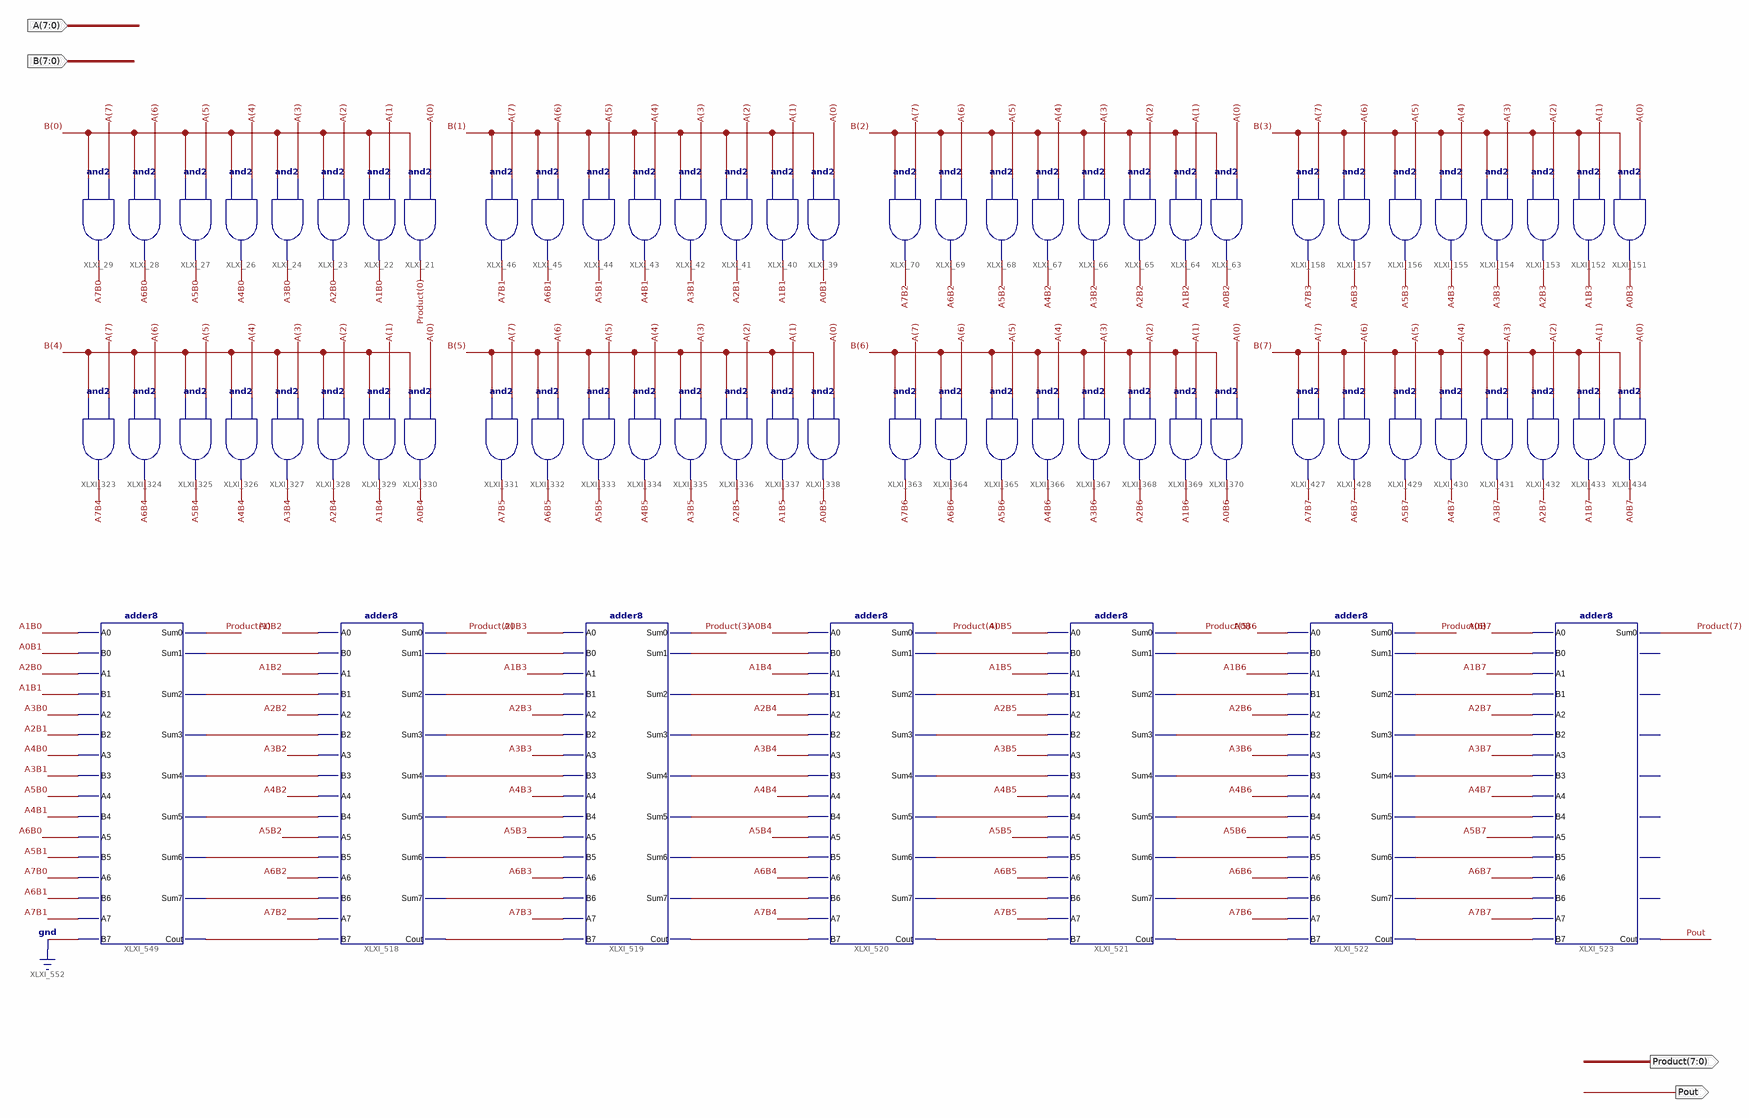
[diagram p0: schematic sheet 1]
// Xilinx ISE schematic EightBitMultiplier.sch (spartan6) as structural Verilog: 71 symbols, 4 ports
module EightBitMultiplier (
  input  [7:0] A,
  input  [7:0] B,
  output [7:0] Product,
  output Pout
);

  wire A0B1, A0B2, A0B3, A0B4, A0B5, A0B6, A0B7, A1B0, A1B1, A1B2, A1B3, A1B4, A1B5, A1B6, A1B7, A2B0, A2B1,
       A2B2, A2B3, A2B4, A2B5, A2B6, A2B7, A3B0, A3B1, A3B2, A3B3, A3B4, A3B5, A3B6, A3B7, A4B0, A4B1, A4B2,
       A4B3, A4B4, A4B5, A4B6, A4B7, A5B0, A5B1, A5B2, A5B3, A5B4, A5B5, A5B6, A5B7, A6B0, A6B1, A6B2, A6B3,
       A6B4, A6B5, A6B6, A6B7, A7B0, A7B1, A7B2, A7B3, A7B4, A7B5, A7B6, A7B7, XLXN_638, XLXN_1408,
       XLXN_1409, XLXN_1410, XLXN_1411, XLXN_1412, XLXN_1413, XLXN_1414, XLXN_1415, XLXN_1514, XLXN_1515,
       XLXN_1516, XLXN_1517, XLXN_1518, XLXN_1519, XLXN_1520, XLXN_1521, XLXN_1522, XLXN_1523, XLXN_1524,
       XLXN_1525, XLXN_1526, XLXN_1527, XLXN_1528, XLXN_1545, XLXN_1546, XLXN_1547, XLXN_1548, XLXN_1549,
       XLXN_1550, XLXN_1551, XLXN_1552, XLXN_1570, XLXN_1571, XLXN_1572, XLXN_1573, XLXN_1574, XLXN_1575,
       XLXN_1576, XLXN_1577, XLXN_1595, XLXN_1596, XLXN_1597, XLXN_1598, XLXN_1599, XLXN_1600, XLXN_1601,
       XLXN_1602;

  and XLXI_29 (A7B0, B[0], A[7]);
  and XLXI_28 (A6B0, B[0], A[6]);
  and XLXI_27 (A5B0, B[0], A[5]);
  and XLXI_26 (A4B0, B[0], A[4]);
  and XLXI_24 (A3B0, B[0], A[3]);
  and XLXI_23 (A2B0, B[0], A[2]);
  and XLXI_22 (A1B0, B[0], A[1]);
  and XLXI_21 (Product[0], B[0], A[0]);
  and XLXI_323 (A7B4, B[4], A[7]);
  and XLXI_324 (A6B4, B[4], A[6]);
  and XLXI_325 (A5B4, B[4], A[5]);
  and XLXI_326 (A4B4, B[4], A[4]);
  and XLXI_327 (A3B4, B[4], A[3]);
  and XLXI_328 (A2B4, B[4], A[2]);
  and XLXI_329 (A1B4, B[4], A[1]);
  and XLXI_330 (A0B4, B[4], A[0]);
  and XLXI_331 (A7B5, B[5], A[7]);
  and XLXI_332 (A6B5, B[5], A[6]);
  and XLXI_333 (A5B5, B[5], A[5]);
  and XLXI_334 (A4B5, B[5], A[4]);
  and XLXI_335 (A3B5, B[5], A[3]);
  and XLXI_336 (A2B5, B[5], A[2]);
  and XLXI_337 (A1B5, B[5], A[1]);
  and XLXI_338 (A0B5, B[5], A[0]);
  and XLXI_363 (A7B6, B[6], A[7]);
  and XLXI_364 (A6B6, B[6], A[6]);
  and XLXI_365 (A5B6, B[6], A[5]);
  and XLXI_366 (A4B6, B[6], A[4]);
  and XLXI_367 (A3B6, B[6], A[3]);
  and XLXI_368 (A2B6, B[6], A[2]);
  and XLXI_369 (A1B6, B[6], A[1]);
  and XLXI_370 (A0B6, B[6], A[0]);
  and XLXI_39 (A0B1, B[1], A[0]);
  and XLXI_40 (A1B1, B[1], A[1]);
  and XLXI_41 (A2B1, B[1], A[2]);
  and XLXI_42 (A3B1, B[1], A[3]);
  and XLXI_43 (A4B1, B[1], A[4]);
  and XLXI_44 (A5B1, B[1], A[5]);
  and XLXI_45 (A6B1, B[1], A[6]);
  and XLXI_46 (A7B1, B[1], A[7]);
  and XLXI_63 (A0B2, B[2], A[0]);
  and XLXI_64 (A1B2, B[2], A[1]);
  and XLXI_65 (A2B2, B[2], A[2]);
  and XLXI_66 (A3B2, B[2], A[3]);
  and XLXI_67 (A4B2, B[2], A[4]);
  and XLXI_68 (A5B2, B[2], A[5]);
  and XLXI_69 (A6B2, B[2], A[6]);
  and XLXI_70 (A7B2, B[2], A[7]);
  and XLXI_151 (A0B3, B[3], A[0]);
  and XLXI_152 (A1B3, B[3], A[1]);
  and XLXI_153 (A2B3, B[3], A[2]);
  and XLXI_154 (A3B3, B[3], A[3]);
  and XLXI_155 (A4B3, B[3], A[4]);
  and XLXI_156 (A5B3, B[3], A[5]);
  and XLXI_157 (A6B3, B[3], A[6]);
  and XLXI_158 (A7B3, B[3], A[7]);
  and XLXI_427 (A7B7, B[7], A[7]);
  and XLXI_428 (A6B7, B[7], A[6]);
  and XLXI_429 (A5B7, B[7], A[5]);
  and XLXI_430 (A4B7, B[7], A[4]);
  and XLXI_431 (A3B7, B[7], A[3]);
  and XLXI_432 (A2B7, B[7], A[2]);
  and XLXI_433 (A1B7, B[7], A[1]);
  and XLXI_434 (A0B7, B[7], A[0]);
  adder8 XLXI_523 (
    .A0(A0B7), .B0(XLXN_1602), .A1(A1B7), .B6(XLXN_1596), .B7(XLXN_1595), .B5(XLXN_1597), .B4(XLXN_1598),
    .B3(XLXN_1599), .B2(XLXN_1600), .B1(XLXN_1601), .A2(A2B7), .A3(A3B7), .A4(A4B7), .A5(A5B7), .A6(A6B7),
    .A7(A7B7), .Cout(Pout), .Sum0(Product[7]));  // open: Sum6, Sum7, Sum5, Sum4, Sum3, Sum2, Sum1
  adder8 XLXI_522 (
    .A0(A0B6), .B0(XLXN_1577), .A1(A1B6), .B6(XLXN_1571), .B7(XLXN_1570), .B5(XLXN_1572), .B4(XLXN_1573),
    .B3(XLXN_1574), .B2(XLXN_1575), .B1(XLXN_1576), .A2(A2B6), .A3(A3B6), .A4(A4B6), .A5(A5B6), .A6(A6B6),
    .A7(A7B6), .Sum6(XLXN_1597), .Cout(XLXN_1595), .Sum7(XLXN_1596), .Sum5(XLXN_1598), .Sum4(XLXN_1599),
    .Sum3(XLXN_1600), .Sum2(XLXN_1601), .Sum0(Product[6]), .Sum1(XLXN_1602));
  adder8 XLXI_520 (
    .A0(A0B4), .B0(XLXN_1528), .A1(A1B4), .B6(XLXN_1522), .B7(XLXN_1521), .B5(XLXN_1523), .B4(XLXN_1524),
    .B3(XLXN_1525), .B2(XLXN_1526), .B1(XLXN_1527), .A2(A2B4), .A3(A3B4), .A4(A4B4), .A5(A5B4), .A6(A6B4),
    .A7(A7B4), .Sum6(XLXN_1547), .Cout(XLXN_1545), .Sum7(XLXN_1546), .Sum5(XLXN_1548), .Sum4(XLXN_1549),
    .Sum3(XLXN_1550), .Sum2(XLXN_1551), .Sum0(Product[4]), .Sum1(XLXN_1552));
  adder8 XLXI_519 (
    .A0(A0B3), .B0(XLXN_1520), .A1(A1B3), .B6(XLXN_1515), .B7(XLXN_1514), .B5(XLXN_638), .B4(XLXN_1516),
    .B3(XLXN_1517), .B2(XLXN_1518), .B1(XLXN_1519), .A2(A2B3), .A3(A3B3), .A4(A4B3), .A5(A5B3), .A6(A6B3),
    .A7(A7B3), .Sum6(XLXN_1523), .Cout(XLXN_1521), .Sum7(XLXN_1522), .Sum5(XLXN_1524), .Sum4(XLXN_1525),
    .Sum3(XLXN_1526), .Sum2(XLXN_1527), .Sum0(Product[3]), .Sum1(XLXN_1528));
  adder8 XLXI_518 (
    .A0(A0B2), .B0(XLXN_1408), .A1(A1B2), .B6(XLXN_1414), .B7(XLXN_1415), .B5(XLXN_1413), .B4(XLXN_1412),
    .B3(XLXN_1411), .B2(XLXN_1410), .B1(XLXN_1409), .A2(A2B2), .A3(A3B2), .A4(A4B2), .A5(A5B2), .A6(A6B2),
    .A7(A7B2), .Sum6(XLXN_638), .Cout(XLXN_1514), .Sum7(XLXN_1515), .Sum5(XLXN_1516), .Sum4(XLXN_1517),
    .Sum3(XLXN_1518), .Sum2(XLXN_1519), .Sum0(Product[2]), .Sum1(XLXN_1520));
  adder8 XLXI_549 (
    .A0(A1B0), .B0(A0B1), .A1(A2B0), .B6(A6B1), .B7(1'b0), .B5(A5B1), .B4(A4B1), .B3(A3B1), .B2(A2B1),
    .B1(A1B1), .A2(A3B0), .A3(A4B0), .A4(A5B0), .A5(A6B0), .A6(A7B0), .A7(A7B1), .Sum6(XLXN_1413),
    .Cout(XLXN_1415), .Sum7(XLXN_1414), .Sum5(XLXN_1412), .Sum4(XLXN_1411), .Sum3(XLXN_1410),
    .Sum2(XLXN_1409), .Sum0(Product[1]), .Sum1(XLXN_1408));
  adder8 XLXI_521 (
    .A0(A0B5), .B0(XLXN_1552), .A1(A1B5), .B6(XLXN_1546), .B7(XLXN_1545), .B5(XLXN_1547), .B4(XLXN_1548),
    .B3(XLXN_1549), .B2(XLXN_1550), .B1(XLXN_1551), .A2(A2B5), .A3(A3B5), .A4(A4B5), .A5(A5B5), .A6(A6B5),
    .A7(A7B5), .Sum6(XLXN_1572), .Cout(XLXN_1570), .Sum7(XLXN_1571), .Sum5(XLXN_1573), .Sum4(XLXN_1574),
    .Sum3(XLXN_1575), .Sum2(XLXN_1576), .Sum0(Product[5]), .Sum1(XLXN_1577));
endmodule
